# Altium schematic sheet MRAM.SchDoc
size 420 x 297 mm; SheetNumber: 8; SheetTotal: 17
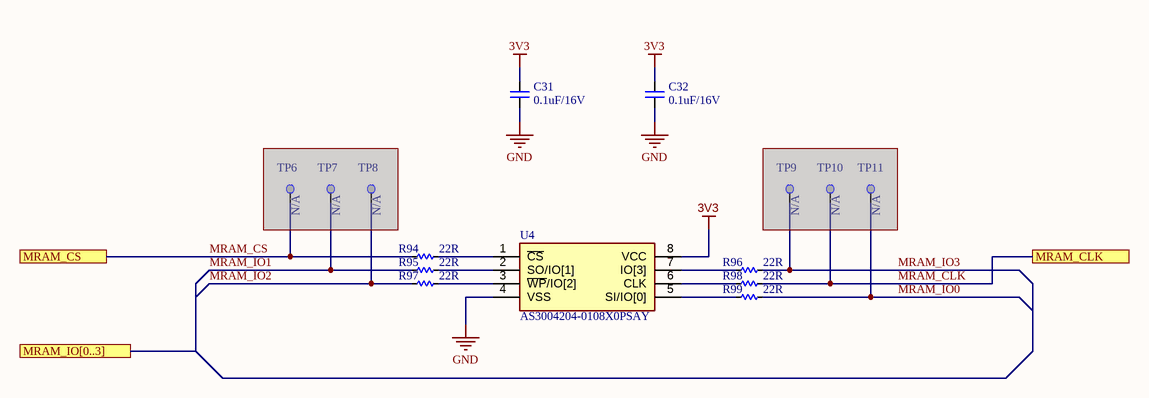
[diagram p0: MRAM.SchDoc]

## Parts
C31  0.1uF/16V  [CAP_C_1608X80]
C32  0.1uF/16V  [CAP_C_1608X80]
R94  22R  [RES_C_1608X60]
R95  22R  [RES_C_1608X60]
R96  22R  [RES_C_1608X60]
R97  22R  [RES_C_1608X60]
R98  22R  [RES_C_1608X60]
R99  22R  [RES_C_1608X60]
TP6  Test Point  [TESTPOINT]  (value not drawn)  (no BOM)  (masked out: inside a compile mask, not in the netlist)
TP7  Test Point  [TESTPOINT]  (value not drawn)  (no BOM)  (masked out: inside a compile mask, not in the netlist)
TP8  Test Point  [TESTPOINT]  (value not drawn)  (no BOM)  (masked out: inside a compile mask, not in the netlist)
TP9  Test Point  [TESTPOINT]  (value not drawn)  (no BOM)  (masked out: inside a compile mask, not in the netlist)
TP10  Test Point  [TESTPOINT]  (value not drawn)  (no BOM)  (masked out: inside a compile mask, not in the netlist)
TP11  Test Point  [TESTPOINT]  (value not drawn)  (no BOM)  (masked out: inside a compile mask, not in the netlist)
U4  AS3004204-0108X0PSAY  [SOIC127P790X216-8N]

## Ports
MRAM_CLK, MRAM_CS, MRAM_IO[0..3]

## Nets
3V3: C31.2 C32.2 U4.8(VCC)
GND: C31.1 C32.1 U4.4(VSS)
MRAM_CLK: R98.2 ; port MRAM_CLK
MRAM_CS: R94.1 ; port MRAM_CS
MRAM_IO0: R99.2
MRAM_IO1: R95.1
MRAM_IO2: R97.1
MRAM_IO3: R96.2
NetR94_2: R94.2 U4.1(~{CS})
NetR95_2: R95.2 U4.2(SO/IO[1])
NetR96_1: R96.1 U4.7(IO[3])
NetR97_2: R97.2 U4.3(~{WP}/IO[2])
NetR98_1: R98.1 U4.6(CLK)
NetR99_1: R99.1 U4.5(SI/IO[0])

## Notes on the sheet
- Project:
- BEE-PC1
- Sub-system:
- NANORACK_EXP_CONTROLLER
- Design by:
- SANG HUYNH
- BAO BUI Q.
- Sheet title:
- Sheet
- A3
- of
- Checked by:
- Approved by:
- VU PHAM
- Revision:
- Document No:
- V1.2.2
- Size:
- Date:

## Library data of the parts
C31 C32 = CAP_SMD: CAP_Chip; Value: 33pF
R94-R99 = _RES_B_2: RES
TP6-TP11 = MCD-00630: Test Point 0.3mm; Part_Type: Misc; Part_Preference: Recommended; Initial_Board_Reference: MB1264; ID: 3115; ShowFields: YES; Component_Country_Of_Origin: Unknown; Internal_Part_Number: MCD-00630; Status: Released; ECCN_US: n/a; ECCN_EU: n/a; Provided_By: n/a; Manufacturer: N/A; Manufacturer_Part_Number: N/A; Order_Code_Digikey: N/A; Order_Code_Farnell: N/A; Order_Code_RS: N/A; Value: N/A; ComponentLink1URL: http://tunmcdsvn.tun.st.com/Component_Documentation_Library/Trunk; Manufacturer_HQ_COO: Unknown
U4 = AS3004204-0108X0PSAY: MRAM Avalanche High Performance Serial P-SRAM 4Mb in SOIC8 package with QSPI - 108MHz interface, 3V, -40 C to 105 C; Manufacturer_Name: Avalanche Technology; Geometry.Height: 2.16mm; Manufacturer_Part_Number: AS3004204-0108X0PSAY; Mouser Part Number: 793-30042040108X0PSY; Mouser Price/Stock: https://www.mouser.co.uk/ProductDetail/Avalanche-Technology/AS3004204-0108X0PSAY/?qs=eP2BKZSCXI7G0ggegRejGg%3D%3D; Arrow Part Number: *; Arrow Price/Stock: *; Datasheet Link: https://www.mouser.ph/ProductDetail/Avalanche-Technology/AS3004204-0108X0PSAY?qs=eP2BKZSCXI7G0ggegRejGg%3D%3D